# EAGLE board u1200 (EAGLE 9.6.2)
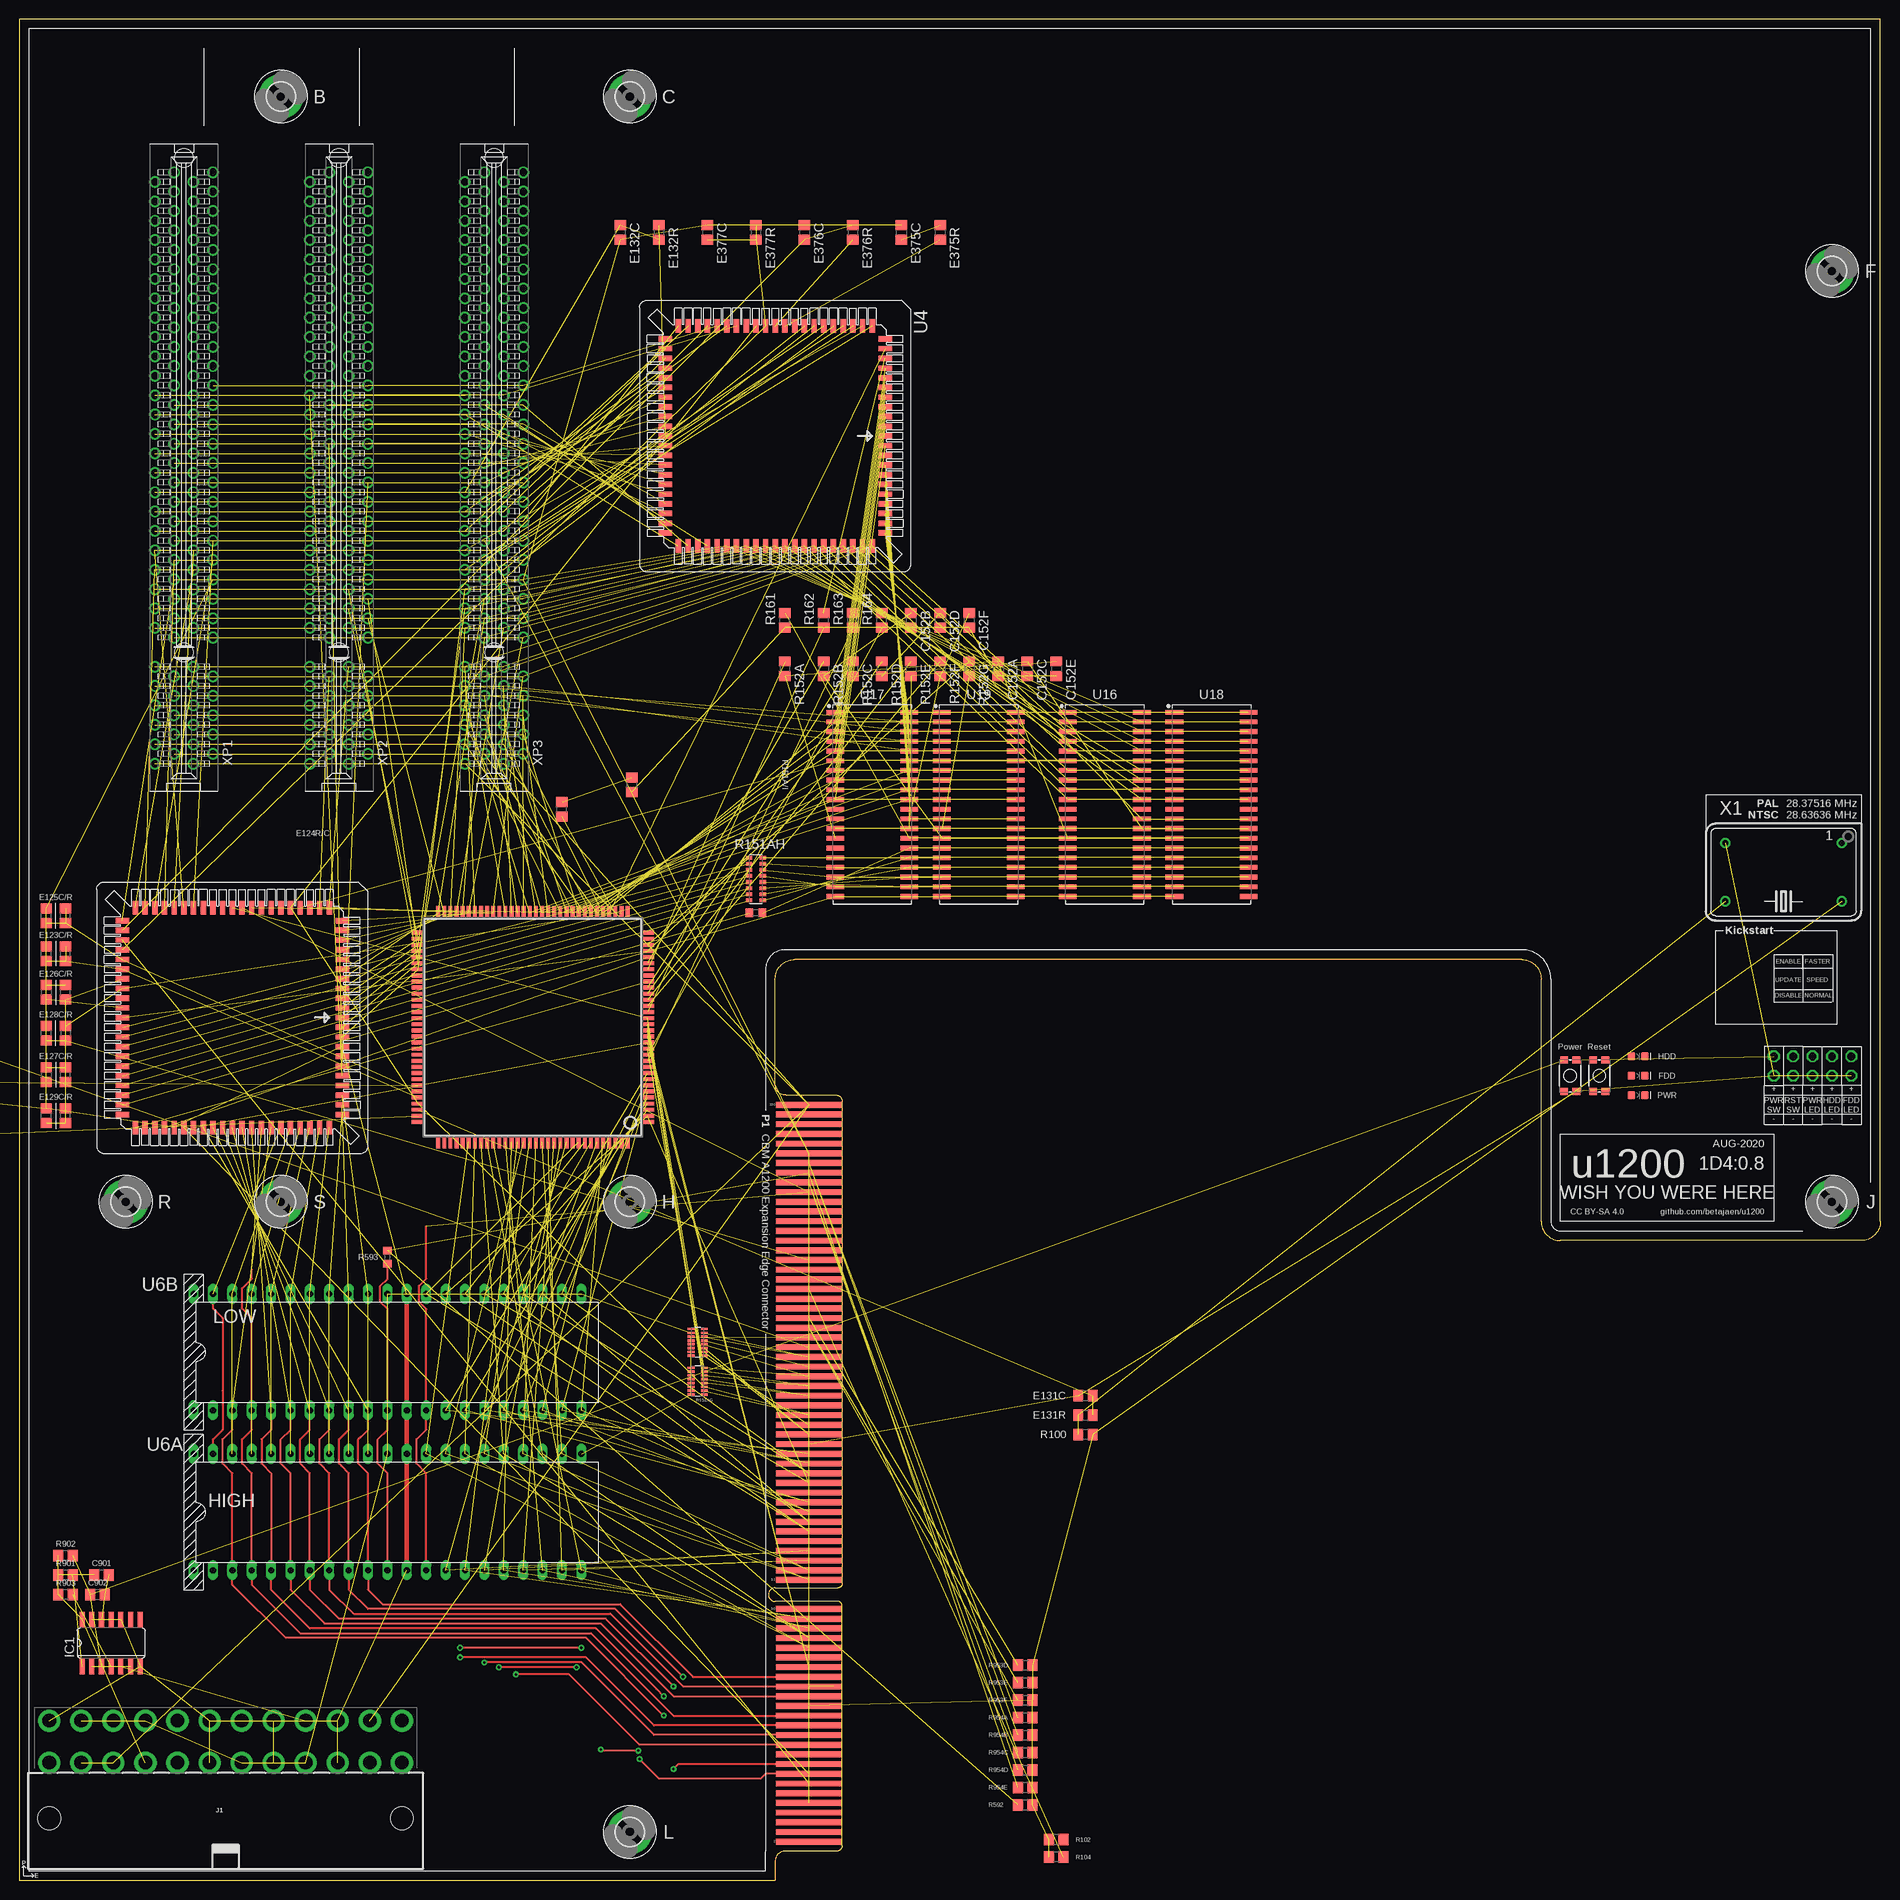
[diagram p13: board, top side]
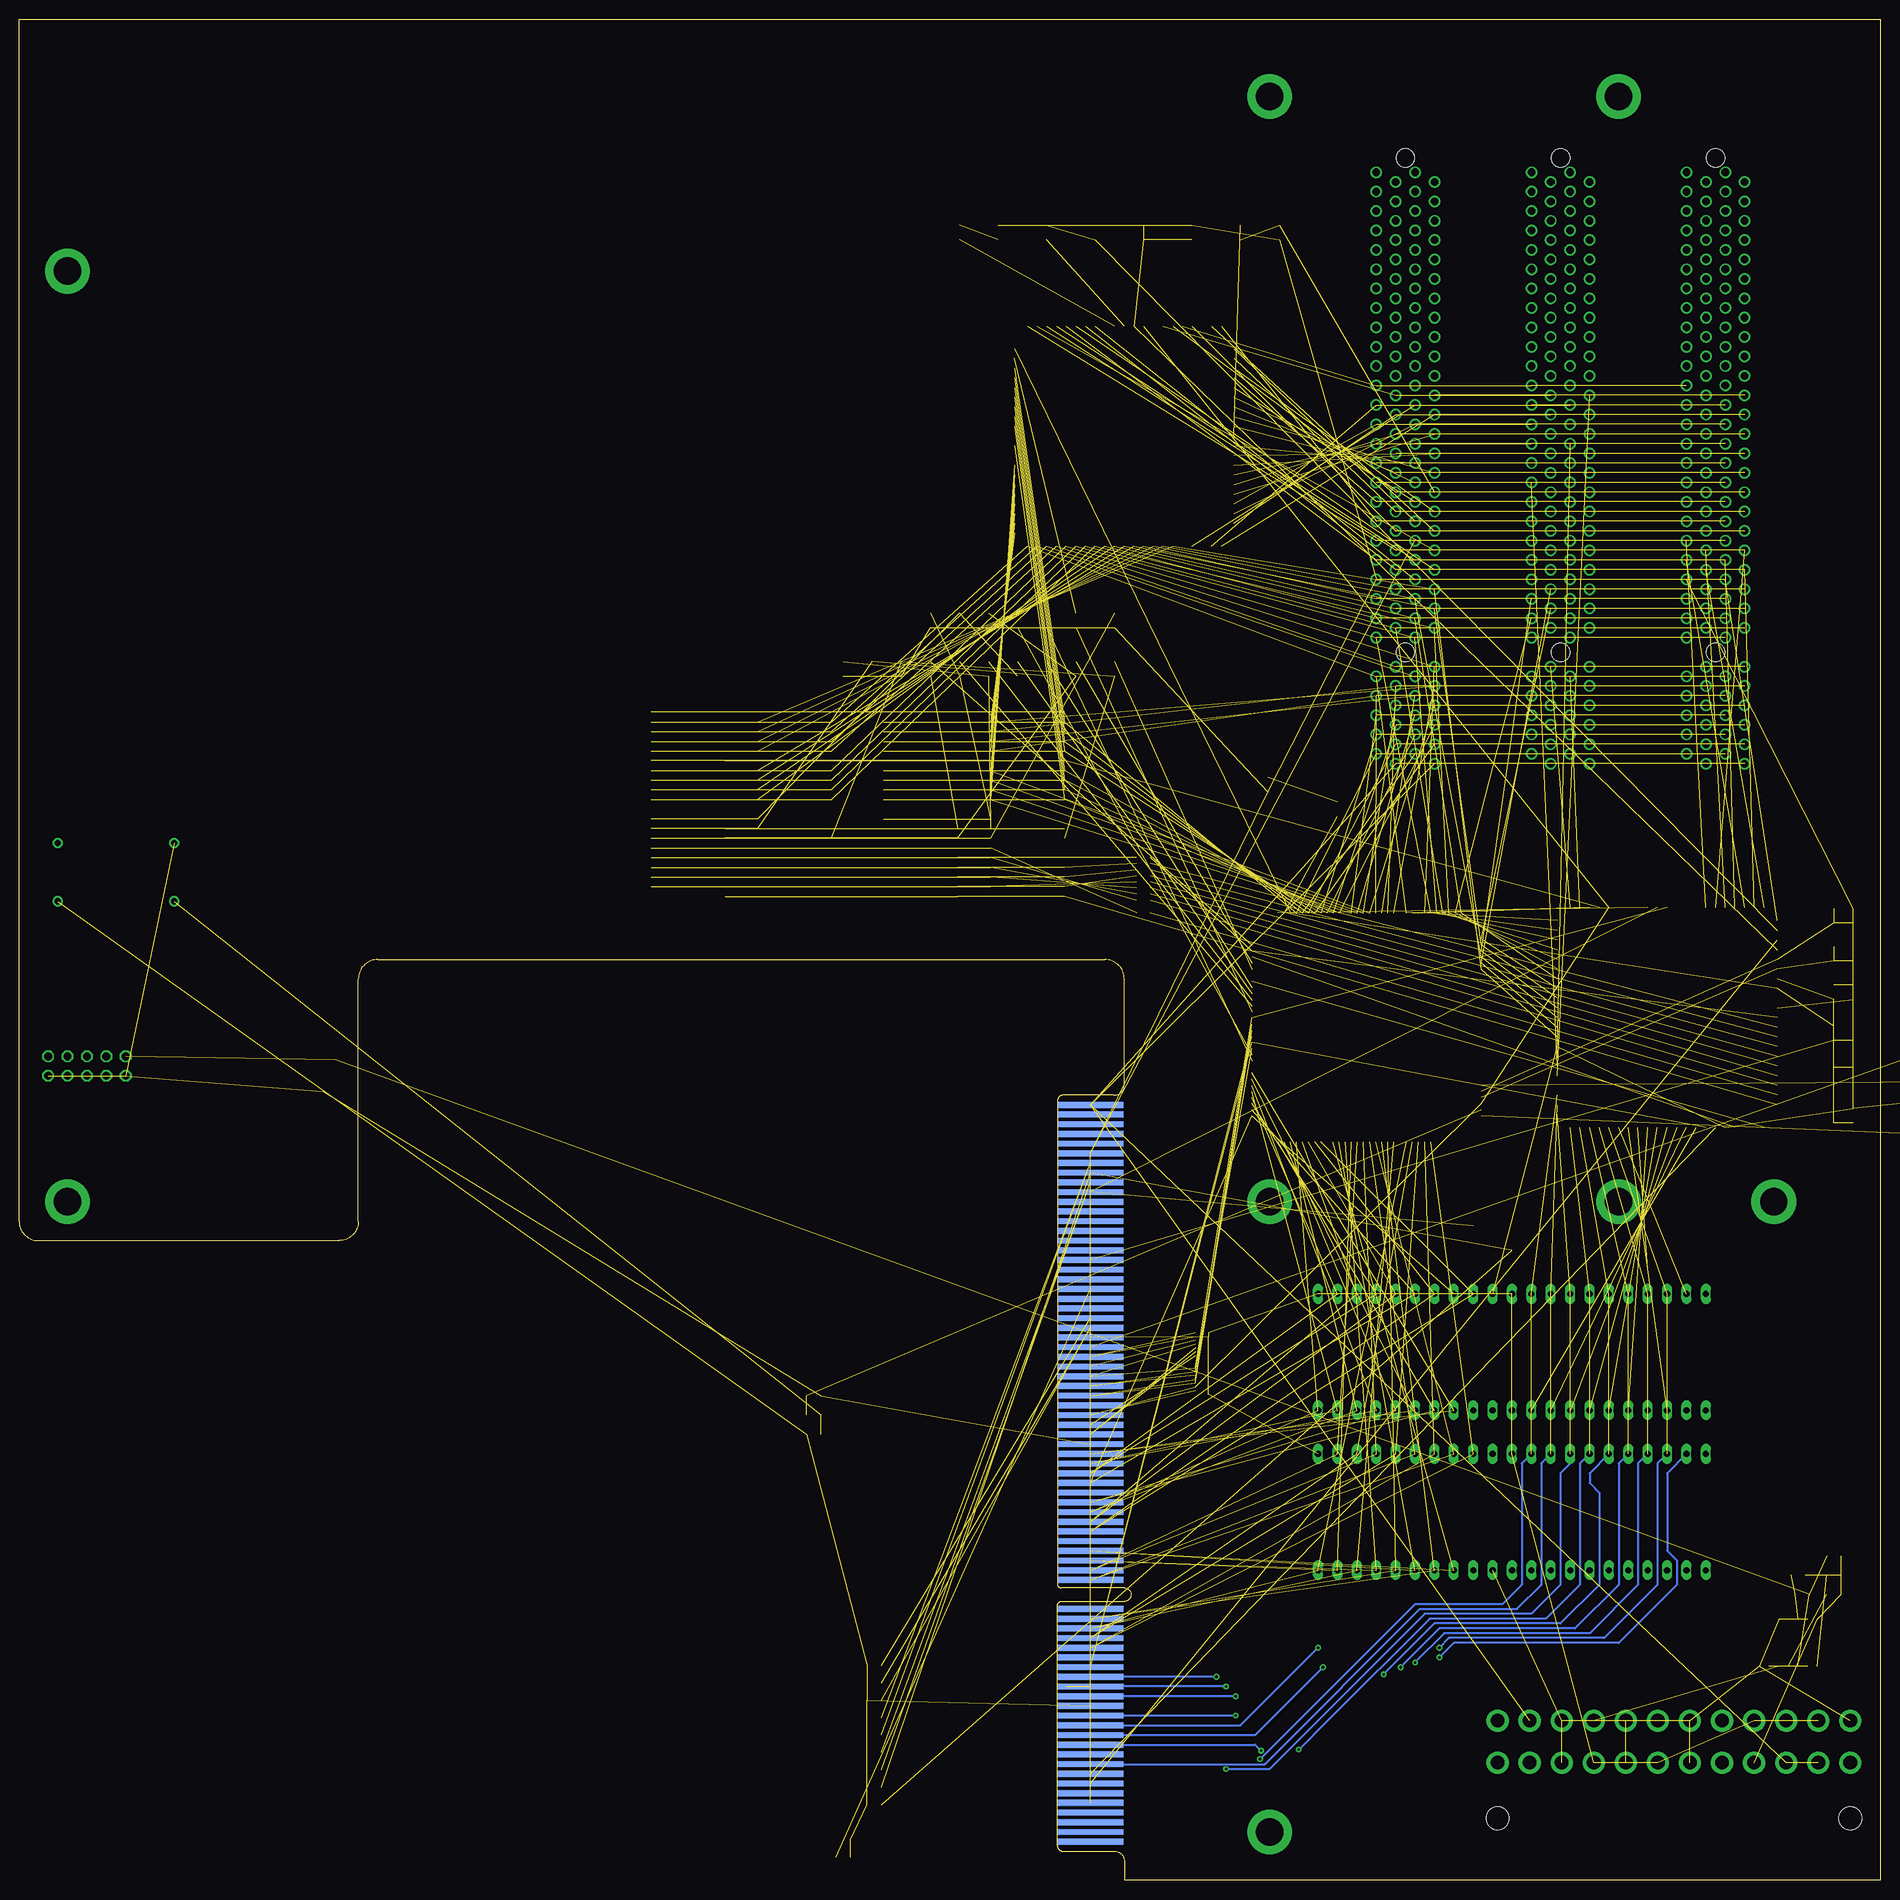
[diagram p14: board, bottom side, seen from below]

Size 243.84 x 243.84 mm. Coordinates in mm from the lower left corner, seen from the top.
Outline: 99.06,0 0,0 0,243.84 243.84,243.84 243.84,86.36 arc-90 241.3,83.82 201.93,83.82 arc-90 199.39,86.36 199.39,118.11 arc90 196.85,120.65 101.6,120.65 arc90 99.06,118.11 99.06,110.49
Copper layers (1*16): Top 0.035mm / dielectric 1.5mm / Bottom 0.035mm
Design rules "default": minimum track width 6mil, minimum drill 0.35mm, track to track 6mil, track to pad 6mil, pad to pad 6mil, via to via 6mil, smd to smd 6mil, copper to edge 40mil, drill to drill 6mil, minimum pad ring 10mil, minimum via ring 8mil, stop-mask expansion 4mil, vias tented up to drill 0mil, thermal gap 10mil
Net classes: 0 default: width 0.254 mm; 1 GND: width 0.61 mm; 2 VCC: width 0.61 mm; 3 +12V: width 0.711 mm; 4 -12V: width 0.711 mm; 5 GND_AUDIO: width 0.61 mm

## Footprints (pad centres in the part's own frame; a part is rotated, then mirrored left to right if it is on the bottom)
C0805 = smd 1.3 x 1.5: 1 -0.95,0; 2 0.95,0
R0805 = smd 1.3 x 1.5: 1 -0.95,0; 2 0.95,0
3,6-PAD = drill 3.6 pad 5.842: B3,6 0,0
SO14 = smd 0.66 x 2.032: 1 -3.81,-3.073; 2 -2.54,-3.073; 3 -1.27,-3.073; 4 0,-3.073; 5 1.27,-3.073; 6 2.54,-3.073; 7 3.81,-3.073; 8 3.81,3.073; 9 2.54,3.073; 10 1.27,3.073; 11 0,3.073; 12 -1.27,3.073; 13 -2.54,3.073; 14 -3.81,3.073
ATX24_RIGHT_ANGLE = drill 1.8 pad 2.9: 1 23.1,4.76; 2 18.9,4.76; 3 14.7,4.76; 4 10.5,4.76; 5 6.3,4.76; 6 2.1,4.76; 7 -2.1,4.76; 8 -6.3,4.76; 9 -10.5,4.76; 10 -14.7,4.76; 11 -18.9,4.76; 12 -23.1,4.76; 13 23.1,10.26; 14 18.9,10.26; 15 14.7,10.26; 16 10.5,10.26; 17 6.3,10.26; 18 2.1,10.26; 19 -2.1,10.26; 20 -6.3,10.26; 21 -10.5,10.26; 22 -14.7,10.26; 23 -18.9,10.26; 24 -23.1,10.26 | hole 3: -23.1,-2.54; 23.1,-2.54
U1200_PINHEAD_2X05_ANNOTATED = drill 1.016 octagon: 1 -5.08,-1.27; 2 -5.08,1.27; 3 -2.54,-1.27; 4 -2.54,1.27; 5 0,-1.27; 6 0,1.27; 7 2.54,-1.27; 8 2.54,1.27; 9 5.08,-1.27; 10 5.08,1.27
LED-0603 = smd 1 x 1: A -0.877,0; C 0.877,0
CBM_A1200_EDGE_CONNECTOR_150P = smd 0.762 x 8.636 bottom: P$1 0,-0.635; P$3 -1.27,-0.635; P$5 -2.54,-0.635; P$7 -3.81,-0.635; P$9 -5.08,-0.635; P$11 -6.35,-0.635; P$13 -7.62,-0.635; P$15 -8.89,-0.635; P$17 -10.16,-0.635; P$19 -11.43,-0.635; P$21 -12.7,-0.635; P$23 -13.97,-0.635; P$25 -15.24,-0.635; P$27 -16.51,-0.635; P$29 -17.78,-0.635; P$31 -19.05,-0.635; P$33 -20.32,-0.635; P$35 -21.59,-0.635; P$37 -22.86,-0.635; P$39 -24.13,-0.635; P$41 -25.4,-0.635; P$43 -26.67,-0.635; P$45 -27.94,-0.635; P$47 -29.21,-0.635; P$49 -30.48,-0.635; P$51 -34.29,-0.635; P$53 -35.56,-0.635; P$55 -36.83,-0.635; P$57 -38.1,-0.635; P$59 -39.37,-0.635; P$61 -40.64,-0.635; P$63 -41.91,-0.635; P$65 -43.18,-0.635; P$67 -44.45,-0.635; P$69 -45.72,-0.635; P$71 -46.99,-0.635; P$73 -48.26,-0.635; P$75 -49.53,-0.635; P$77 -50.8,-0.635; P$79 -52.07,-0.635; P$81 -53.34,-0.635; P$83 -54.61,-0.635; P$85 -55.88,-0.635; P$87 -57.15,-0.635; P$89 -58.42,-0.635; P$91 -59.69,-0.635; P$93 -60.96,-0.635; P$95 -62.23,-0.635; P$97 -63.5,-0.635; P$99 -64.77,-0.635; P$101 -66.04,-0.635; P$103 -67.31,-0.635; P$105 -68.58,-0.635; P$107 -69.85,-0.635; P$109 -71.12,-0.635; P$111 -72.39,-0.635; P$113 -73.66,-0.635; P$115 -74.93,-0.635; P$117 -76.2,-0.635; P$119 -77.47,-0.635; P$121 -78.74,-0.635; P$123 -80.01,-0.635; P$125 -81.28,-0.635; P$127 -82.55,-0.635; P$129 -83.82,-0.635; P$131 -85.09,-0.635; P$133 -86.36,-0.635; P$135 -87.63,-0.635; P$137 -88.9,-0.635; P$139 -90.17,-0.635; P$141 -91.44,-0.635; P$143 -92.71,-0.635; P$145 -93.98,-0.635; P$147 -95.25,-0.635; P$149 -96.52,-0.635 | smd 0.762 x 8.636: P$2 0,-0.635; P$4 -1.27,-0.635; P$6 -2.54,-0.635; P$8 -3.81,-0.635; P$10 -5.08,-0.635; P$12 -6.35,-0.635; P$14 -7.62,-0.635; P$16 -8.89,-0.635; P$18 -10.16,-0.635; P$20 -11.43,-0.635; P$22 -12.7,-0.635; P$24 -13.97,-0.635; P$26 -15.24,-0.635; P$28 -16.51,-0.635; P$30 -17.78,-0.635; P$32 -19.05,-0.635; P$34 -20.32,-0.635; P$36 -21.59,-0.635; P$38 -22.86,-0.635; P$40 -24.13,-0.635; P$42 -25.4,-0.635; P$44 -26.67,-0.635; P$46 -27.94,-0.635; P$48 -29.21,-0.635; P$50 -30.48,-0.635; P$52 -34.29,-0.635; P$54 -35.56,-0.635; P$56 -36.83,-0.635; P$58 -38.1,-0.635; P$60 -39.37,-0.635; P$62 -40.64,-0.635; P$64 -41.91,-0.635; P$66 -43.18,-0.635; P$68 -44.45,-0.635; P$70 -45.72,-0.635; P$72 -46.99,-0.635; P$74 -48.26,-0.635; P$76 -49.53,-0.635; P$78 -50.8,-0.635; P$80 -52.07,-0.635; P$82 -53.34,-0.635; P$84 -54.61,-0.635; P$86 -55.88,-0.635; P$88 -57.15,-0.635; P$90 -58.42,-0.635; P$92 -59.69,-0.635; P$94 -60.96,-0.635; P$96 -62.23,-0.635; P$98 -63.5,-0.635; P$100 -64.77,-0.635; P$102 -66.04,-0.635; P$104 -67.31,-0.635; P$106 -68.58,-0.635; P$108 -69.85,-0.635; P$110 -71.12,-0.635; P$112 -72.39,-0.635; P$114 -73.66,-0.635; P$116 -74.93,-0.635; P$118 -76.2,-0.635; P$120 -77.47,-0.635; P$122 -78.74,-0.635; P$124 -80.01,-0.635; P$126 -81.28,-0.635; P$128 -82.55,-0.635; P$130 -83.82,-0.635; P$132 -85.09,-0.635; P$134 -86.36,-0.635; P$136 -87.63,-0.635; P$138 -88.9,-0.635; P$140 -90.17,-0.635; P$142 -91.44,-0.635; P$144 -92.71,-0.635; P$146 -93.98,-0.635; P$148 -95.25,-0.635; P$150 -96.52,-0.635
TACTILE_SWITCH_SMD_4.6X2.8MM = smd 0.9 x 1: 1 -2.05,-0.8; 2 2.05,-0.8; 3 2.05,0.8; 4 -2.05,0.8
741X163220JP = smd 0.878 x 0.297: 1 -0.867,1.75; 8 -0.867,-1.75; 9 0.867,-1.75; 16 0.867,1.75 | smd 0.878 x 0.31: 2 -0.867,1.25; 3 -0.867,0.75; 4 -0.867,0.25; 5 -0.867,-0.25; 6 -0.867,-0.75; 7 -0.867,-1.25; 10 0.867,-1.25; 11 0.867,-0.75; 12 0.867,-0.25; 13 0.867,0.25; 14 0.867,0.75; 15 0.867,1.25
742C163220JP = smd 0.792 x 0.472: 1 -0.91,2.8; 2 -0.91,2; 3 -0.91,1.2; 4 -0.91,0.4; 5 -0.91,-0.4; 6 -0.91,-1.2; 7 -0.91,-2; 8 -0.91,-2.8; 9 0.91,-2.8; 10 0.91,-2; 11 0.91,-1.2; 12 0.91,-0.4; 13 0.91,0.4; 14 0.91,1.2; 15 0.91,2; 16 0.91,2.8
R0603 = smd 1 x 1.1: 1 -0.85,0; 2 0.85,0
PLCC84-SMD-AMP-SOCKED = smd 0.7 x 1.78: 1 0,14.4; 2 -1.27,14.4; 3 -2.54,14.4; 4 -3.81,14.4; 5 -5.08,14.4; 6 -6.35,14.4; 7 -7.62,14.4; 8 -8.89,14.4; 9 -10.16,14.4; 10 -11.43,14.4; 11 -12.7,14.4; 33 -12.7,-14.4; 34 -11.43,-14.4; 35 -10.16,-14.4; 36 -8.89,-14.4; 37 -7.62,-14.4; 38 -6.35,-14.4; 39 -5.08,-14.4; 40 -3.81,-14.4; 41 -2.54,-14.4; 42 -1.27,-14.4; 43 0,-14.4; 44 1.27,-14.4; 45 2.54,-14.4; 46 3.81,-14.4; 47 5.08,-14.4; 48 6.35,-14.4; 49 7.62,-14.4; 50 8.89,-14.4; 51 10.16,-14.4; 52 11.43,-14.4; 53 12.7,-14.4; 75 12.7,14.4; 76 11.43,14.4; 77 10.16,14.4; 78 8.89,14.4; 79 7.62,14.4; 80 6.35,14.4; 81 5.08,14.4; 82 3.81,14.4; 83 2.54,14.4; 84 1.27,14.4 | smd 1.78 x 0.7: 12 -14.4,12.7; 13 -14.4,11.43; 14 -14.4,10.16; 15 -14.4,8.89; 16 -14.4,7.62; 17 -14.4,6.35; 18 -14.4,5.08; 19 -14.4,3.81; 20 -14.4,2.54; 21 -14.4,1.27; 22 -14.4,0; 23 -14.4,-1.27; 24 -14.4,-2.54; 25 -14.4,-3.81; 26 -14.4,-5.08; 27 -14.4,-6.35; 28 -14.4,-7.62; 29 -14.4,-8.89; 30 -14.4,-10.16; 31 -14.4,-11.43; 32 -14.4,-12.7; 54 14.4,-12.7; 55 14.4,-11.43; 56 14.4,-10.16; 57 14.4,-8.89; 58 14.4,-7.62; 59 14.4,-6.35; 60 14.4,-5.08; 61 14.4,-3.81; 62 14.4,-2.54; 63 14.4,-1.27; 64 14.4,0; 65 14.4,1.27; 66 14.4,2.54; 67 14.4,3.81; 68 14.4,5.08; 69 14.4,6.35; 70 14.4,7.62; 71 14.4,8.89; 72 14.4,10.16; 73 14.4,11.43; 74 14.4,12.7
CBM_A1200_ROM_DIL42 = drill 0.813 long: 1 -25.4,-7.62; 2 -22.86,-7.62; 3 -20.32,-7.62; 4 -17.78,-7.62; 5 -15.24,-7.62; 6 -12.7,-7.62; 7 -10.16,-7.62; 8 -7.62,-7.62; 9 -5.08,-7.62; 10 -2.54,-7.62; 11 0,-7.62; 12 2.54,-7.62; 13 5.08,-7.62; 14 7.62,-7.62; 15 10.16,-7.62; 16 12.7,-7.62; 17 15.24,-7.62; 18 17.78,-7.62; 19 20.32,-7.62; 20 22.86,-7.62; 21 25.4,-7.62; 22 25.4,7.62; 23 22.86,7.62; 24 20.32,7.62; 25 17.78,7.62; 26 15.24,7.62; 27 12.7,7.62; 28 10.16,7.62; 29 7.62,7.62; 30 5.08,7.62; 31 2.54,7.62; 32 0,7.62; 33 -2.54,7.62; 34 -5.08,7.62; 35 -7.62,7.62; 36 -10.16,7.62; 37 -12.7,7.62; 38 -15.24,7.62; 39 -17.78,7.62; 40 -20.32,7.62; 41 -22.86,7.62; 42 -25.4,7.62
SOJ127P1117X376-40 = smd 2.315 x 0.612: 1 -4.854,12.065; 2 -4.854,10.795; 3 -4.854,9.525; 4 -4.854,8.255; 5 -4.854,6.985; 6 -4.854,5.715; 7 -4.854,4.445; 8 -4.854,3.175; 9 -4.854,1.905; 10 -4.854,0.635; 11 -4.854,-0.635; 12 -4.854,-1.905; 13 -4.854,-3.175; 14 -4.854,-4.445; 15 -4.854,-5.715; 16 -4.854,-6.985; 17 -4.854,-8.255; 18 -4.854,-9.525; 19 -4.854,-10.795; 20 -4.854,-12.065; 21 4.854,-12.065; 22 4.854,-10.795; 23 4.854,-9.525; 24 4.854,-8.255; 25 4.854,-6.985; 26 4.854,-5.715; 27 4.854,-4.445; 28 4.854,-3.175; 29 4.854,-1.905; 30 4.854,-0.635; 31 4.854,0.635; 32 4.854,1.905; 33 4.854,3.175; 34 4.854,4.445; 35 4.854,5.715; 36 4.854,6.985; 37 4.854,8.255; 38 4.854,9.525; 39 4.854,10.795; 40 4.854,12.065
SQFP-S-28X28-128 = smd 0.5 x 1.8: 1 -12.4,-15; 2 -11.6,-15; 3 -10.8,-15; 4 -10,-15; 5 -9.2,-15; 6 -8.4,-15; 7 -7.6,-15; 8 -6.8,-15; 9 -6,-15; 10 -5.2,-15; 11 -4.4,-15; 12 -3.6,-15; 13 -2.8,-15; 14 -2,-15; 15 -1.2,-15; 16 -0.4,-15; 17 0.4,-15; 18 1.2,-15; 19 2,-15; 20 2.8,-15; 21 3.6,-15; 22 4.4,-15; 23 5.2,-15; 24 6,-15; 25 6.8,-15; 26 7.6,-15; 27 8.4,-15; 28 9.2,-15; 29 10,-15; 30 10.8,-15; 31 11.6,-15; 32 12.4,-15; 65 12.4,15; 66 11.6,15; 67 10.8,15; 68 10,15; 69 9.2,15; 70 8.4,15; 71 7.6,15; 72 6.8,15; 73 6,15; 74 5.2,15; 75 4.4,15; 76 3.6,15; 77 2.8,15; 78 2,15; 79 1.2,15; 80 0.4,15; 81 -0.4,15; 82 -1.2,15; 83 -2,15; 84 -2.8,15; 85 -3.6,15; 86 -4.4,15; 87 -5.2,15; 88 -6,15; 89 -6.8,15; 90 -7.6,15; 91 -8.4,15; 92 -9.2,15; 93 -10,15; 94 -10.8,15; 95 -11.6,15; 96 -12.4,15 | smd 1.8 x 0.5: 33 15,-12.4; 34 15,-11.6; 35 15,-10.8; 36 15,-10; 37 15,-9.2; 38 15,-8.4; 39 15,-7.6; 40 15,-6.8; 41 15,-6; 42 15,-5.2; 43 15,-4.4; 44 15,-3.6; 45 15,-2.8; 46 15,-2; 47 15,-1.2; 48 15,-0.4; 49 15,0.4; 50 15,1.2; 51 15,2; 52 15,2.8; 53 15,3.6; 54 15,4.4; 55 15,5.2; 56 15,6; 57 15,6.8; 58 15,7.6; 59 15,8.4; 60 15,9.2; 61 15,10; 62 15,10.8; 63 15,11.6; 64 15,12.4; 97 -15,12.4; 98 -15,11.6; 99 -15,10.8; 100 -15,10; 101 -15,9.2; 102 -15,8.4; 103 -15,7.6; 104 -15,6.8; 105 -15,6; 106 -15,5.2; 107 -15,4.4; 108 -15,3.6; 109 -15,2.8; 110 -15,2; 111 -15,1.2; 112 -15,0.4; 113 -15,-0.4; 114 -15,-1.2; 115 -15,-2; 116 -15,-2.8; 117 -15,-3.6; 118 -15,-4.4; 119 -15,-5.2; 120 -15,-6; 121 -15,-6.8; 122 -15,-7.6; 123 -15,-8.4; 124 -15,-9.2; 125 -15,-10; 126 -15,-10.8; 127 -15,-11.6; 128 -15,-12.4
DIL14S = drill 0.813: 1 -7.62,-3.81; 7 7.62,-3.81; 8 7.62,3.81; 14 -7.62,3.81
145167-2 = drill 1 pad 1.2: 1 0.254,-1.27; 2 0.254,3.81; 3 1.524,-3.81; 4 1.524,1.27; 5 2.794,-1.27; 6 2.794,3.81; 7 4.064,-3.81; 8 4.064,1.27; 9 5.334,-1.27; 10 5.334,3.81; 11 6.604,-3.81; 12 6.604,1.27; 13 7.874,-1.27; 14 7.874,3.81; 15 9.144,-3.81; 16 9.144,1.27; 17 10.414,-1.27; 18 10.414,3.81; 19 11.684,-3.81; 20 11.684,1.27; 21 12.954,-1.27; 22 12.954,3.81; 23 16.764,-3.81; 24 16.764,1.27; 25 18.034,-1.27; 26 18.034,3.81; 27 19.304,-3.81; 28 19.304,1.27; 29 20.574,-1.27; 30 20.574,3.81; 31 21.844,-3.81; 32 21.844,1.27; 33 23.114,-1.27; 34 23.114,3.81; 35 24.384,-3.81; 36 24.384,1.27; 37 25.654,-1.27; 38 25.654,3.81; 39 26.924,-3.81; 40 26.924,1.27; 41 28.194,-1.27; 42 28.194,3.81; 43 29.464,-3.81; 44 29.464,1.27; 45 30.734,-1.27; 46 30.734,3.81; 47 32.004,-3.81; 48 32.004,1.27; 49 33.274,-1.27; 50 33.274,3.81; 51 34.544,-3.81; 52 34.544,1.27; 53 35.814,-1.27; 54 35.814,3.81; 55 37.084,-3.81; 56 37.084,1.27; 57 38.354,-1.27; 58 38.354,3.81; 59 39.624,-3.81; 60 39.624,1.27; 61 40.894,-1.27; 62 40.894,3.81; 63 42.164,-3.81; 64 42.164,1.27; 65 43.434,-1.27; 66 43.434,3.81; 67 44.704,-3.81; 68 44.704,1.27; 69 45.974,-1.27; 70 45.974,3.81; 71 47.244,-3.81; 72 47.244,1.27; 73 48.514,-1.27; 74 48.514,3.81; 75 49.784,-3.81; 76 49.784,1.27; 77 51.054,-1.27; 78 51.054,3.81; 79 52.324,-3.81; 80 52.324,1.27; 81 53.594,-1.27; 82 53.594,3.81; 83 54.864,-3.81; 84 54.864,1.27; 85 56.134,-1.27; 86 56.134,3.81; 87 57.404,-3.81; 88 57.404,1.27; 89 58.674,-1.27; 90 58.674,3.81; 91 59.944,-3.81; 92 59.944,1.27; 93 61.214,-1.27; 94 61.214,3.81; 95 62.484,-3.81; 96 62.484,1.27; 97 63.754,-1.27; 98 63.754,3.81; 99 65.024,-3.81; 100 65.024,1.27; 101 66.294,-1.27; 102 66.294,3.81; 103 67.564,-3.81; 104 67.564,1.27; 105 68.834,-1.27; 106 68.834,3.81; 107 70.104,-3.81; 108 70.104,1.27; 109 71.374,-1.27; 110 71.374,3.81; 111 72.644,-3.81; 112 72.644,1.27; 113 73.914,-1.27; 114 73.914,3.81; 115 75.184,-3.81; 116 75.184,1.27; 117 76.454,-1.27; 118 76.454,3.81; 119 77.724,-3.81; 120 77.724,1.27 | hole 2.44: 14.854,0; 79.624,0

## Placement (x,y rotation side)
C152A  22pF  [C0805]  128.27,158.75 270 top
C152B  22pF  [C0805]  116.84,165.1 270 top
C152C  22pF  [C0805]  132.08,158.75 270 top
C152D  22pF  [C0805]  120.65,165.1 270 top
C152E  22pF  [C0805]  135.89,158.75 270 top
C152F  22pF  [C0805]  124.46,165.1 270 top
C901  100nF  [C0805]  10.79,40.01 0 top
C902  CPO  [C0805]  10.29,37.47 0 top
E121C  *  [C0805]  -11.68,103.63 270 top  (outside the outline)
E121R  27  [R0805]  -9.02,103.63 90 top  (outside the outline)
E122C  *  [C0805]  -11.68,108.71 270 top  (outside the outline)
E122R  27  [R0805]  -9.02,108.71 90 top  (outside the outline)
E123C  22pF  [C0805]  3.56,121.41 90 top
E123R  27  [R0805]  6.1,121.41 90 top
E124C  22pF  [C0805]  80.26,143.51 270 top
E124R  68  [R0805]  71.12,140.34 90 top
E125C  22pF  [C0805]  3.56,126.36 90 top
E125R  27  [R0805]  6.1,126.36 90 top
E126C  22pF  [C0805]  3.56,116.33 270 top
E126R  27  [R0805]  6.1,116.33 90 top
E127C  22pF  [C0805]  3.56,105.54 270 top
E127R  27  [R0805]  6.1,105.54 90 top
E128C  22pF  [C0805]  3.56,111 90 top
E128R  27  [R0805]  6.1,111 270 top
E129C  22pF  [C0805]  3.56,100.2 90 top
E129R  27  [R0805]  6.1,100.2 90 top
E131C  *  [C0805]  139.7,63.5 180 top
E131R  68  [R0805]  139.7,60.96 0 top
E132C  *  [C0805]  78.74,215.9 270 top
E132R  68  [R0805]  83.82,215.9 270 top
E133C  *  [C0805]  -11.68,98.55 270 top  (outside the outline)
E133R  68  [R0805]  -9.02,98.55 90 top  (outside the outline)
E375C  22pF  [C0805]  115.57,215.9 270 top
E375R  68  [R0805]  120.65,215.9 270 top
E376C  22pF  [C0805]  102.87,215.9 270 top
E376R  68  [R0805]  109.22,215.9 270 top
E377C  22pF  [C0805]  90.17,215.9 270 top
E377R  68  [R0805]  96.52,215.9 270 top
HB  MOUNT-PAD-ROUND3.6  [3,6-PAD]  34.29,233.68 0 top
HC  MOUNT-PAD-ROUND3.6  [3,6-PAD]  80.01,233.68 0 top
HF  MOUNT-PAD-ROUND3.6  [3,6-PAD]  237.49,210.82 0 top
HH  MOUNT-PAD-ROUND3.6  [3,6-PAD]  80.01,88.9 180 top
HJ  MOUNT-PAD-ROUND3.6  [3,6-PAD]  237.49,88.9 0 top
HL  MOUNT-PAD-ROUND3.6  [3,6-PAD]  80.01,6.35 0 top
HR  MOUNT-PAD-ROUND3.6  [3,6-PAD]  13.97,88.9 0 top
HS  MOUNT-PAD-ROUND3.6  [3,6-PAD]  34.29,88.9 0 top
IC1  74LS74D  [SO14]  12.06,31.11 0 top
J1  ATX24RH  [ATX24_RIGHT_ANGLE]  27.05,10.67 0 top
JP1  U1200_JP_CASEU1200_JP_CASE  [U1200_PINHEAD_2X05_ANNOTATED]  234.95,106.68 0 top
LED_FDD  Yellow  [LED-0603]  212.09,105.41 0 top
LED_HDD  RED  [LED-0603]  212.09,107.95 0 top
LED_PWR  GREEN  [LED-0603]  212.09,102.87 0 top
P1  CBM_A1200_EDGE_CONNECTOR  [CBM_A1200_EDGE_CONNECTOR_150P]  104.14,5.08 270 top
PWR_SW  [TACTILE_SWITCH_SMD_4.6X2.8MM]  203.2,105.41 270 top
R100  470  [R0805]  139.7,58.42 180 top
R101_104_952AB  741X163220JP  [741X163220JP]  88.9,70.48 180 top
R102  1K  [R0805]  135.89,5.33 180 top
R104  1K  [R0805]  135.89,3.05 180 top
R151AH  742C043680JP  [742C163220JP]  96.52,131.19 0 top
R151I  68  [R0603]  96.52,126.75 0 top
R152A  68  [R0805]  100.33,158.75 270 top
R152B  68  [R0805]  105.41,158.75 270 top
R152C  68  [R0805]  109.22,158.75 270 top
R152D  68  [R0805]  113.03,158.75 270 top
R152E  68  [R0805]  116.84,158.75 270 top
R152F  68  [R0805]  120.65,158.75 270 top
R152G  68  [R0805]  124.46,158.75 270 top
R161  470  [R0805]  100.33,165.1 90 top
R162  27  [R0805]  105.41,165.1 90 top
R163  68  [R0805]  109.22,165.1 90 top
R164  68  [R0805]  113.03,165.1 90 top
R592  1K  [R0805]  131.83,9.91 0 top
R593  470**  [R0603]  48.26,81.66 270 top
R901  4K7  [R0805]  6.1,40.01 180 top
R902  4K7  [R0805]  6.1,42.55 180 top
R903  4K7  [R0805]  6.1,37.47 180 top
R951AG  741X163220JP  [741X163220JP]  88.9,65.41 180 top
R953D  470  [R0805]  131.83,28.19 0 top
R953E  470  [R0805]  131.83,25.91 0 top
R953F  470  [R0805]  131.83,23.62 0 top
R954A  1K  [R0805]  131.83,21.34 0 top
R954B  1K  [R0805]  131.83,19.05 0 top
R954C  470  [R0805]  131.83,16.76 0 top
R954D  470  [R0805]  131.83,14.48 0 top
R954E  1K  [R0805]  131.83,12.19 0 top
RST_SW  [TACTILE_SWITCH_SMD_4.6X2.8MM]  207.01,105.41 270 top
U2  CBM_8374  [PLCC84-SMD-AMP-SOCKED]  27.94,113.03 270 top
U4  CBM_4203  [PLCC84-SMD-AMP-SOCKED]  99.06,189.23 270 top
U6A  CBM_A1200_ROM_U6AB  [CBM_A1200_ROM_DIL42]  48.26,48.26 0 top
U6B  CBM_A1200_ROM_U6AB  [CBM_A1200_ROM_DIL42]  48.26,69.22 0 top
U16  DRAM_256KX16  [SOJ127P1117X376-40]  142.24,140.97 0 top
U17  DRAM_256KX16  [SOJ127P1117X376-40]  111.76,140.97 0 top
U18  DRAM_256KX16  [SOJ127P1117X376-40]  156.21,140.97 0 top
U19  DRAM_256KX16  [SOJ127P1117X376-40]  125.73,140.97 0 top
U20  CBM_391425  [SQFP-S-28X28-128]  67.31,111.76 90 top
U$1  REF_P5_A1200_PPC_040  [REF_P5_A1200_PPC_040]  100.33,0 0 top
X1  [DIL14S]  231.14,132.08 180 top
XP1  U1200_CHIP_BUS_CONNECTOR  [145167-2]  21.59,146.05 90 top
XP2  U1200_CHIP_BUS_CONNECTOR  [145167-2]  41.91,146.05 90 top
XP3  U1200_CHIP_BUS_CONNECTOR  [145167-2]  62.23,146.05 90 top

## Tracks (layer width: path | path; a pad name or v marks a point on that pad's centre or on a via)
7MHZ  (4 unrouted)
14MHZ  (4 unrouted)
28MHZ  (1 unrouted)
+12V  (5 unrouted)
-12V  (4 unrouted)
_AS  (1 unrouted)
_AVEC  (1 unrouted)
_BCAS_XX  (1 unrouted)
_BEER  (1 unrouted)
_BR  (1 unrouted)
_BRAS(0)  (3 unrouted)
_BRAS(1)  (3 unrouted)
_BRAS_LL  (3 unrouted)
_BRAS_LM  (3 unrouted)
_BRAS_UM  (3 unrouted)
_BRAS_UU  (3 unrouted)
_BWE  (4 unrouted)
_CAS  (1 unrouted)
_CDAC  (4 unrouted)
_CSYNC  (3 unrouted)
_DBR  (1 unrouted)
_DS  (2 unrouted)
_DSACK_0  (1 unrouted)
_DSACK_1  (1 unrouted)
_HLT  (1 unrouted)
_HSYNC  (3 unrouted)
_INT2  (1 unrouted)
_INT6  (1 unrouted)
_MLD  (1 unrouted)
_OE  (1 unrouted)
  Top 0.254: U6A.13 53.34,53.34 52.07,54.61 52.07,57.78 53.34,59.05 U6B.13 53.34,74.85 52.4,75.78 52.4,77.89 53.34,78.82 53.34,85.72
_OVR  (1 unrouted)
_RAS  (1 unrouted)
_ROE  (4 unrouted)
_ROMEN
  Top 0.254: U6A.11 48.26,53.34 46.99,54.61 46.99,57.78 48.26,59.05 U6B.11 48.26,74.85 47.32,75.78 47.32,77.89 48.26,78.82 R593.2
_RST  (4 unrouted)
_VSYNC  (3 unrouted)
_WE  (1 unrouted)
_WIDE  (2 unrouted)
_XBLANK  (3 unrouted)
_XRGB0  (3 unrouted)
_XRGB1  (3 unrouted)
_XRGB2  (3 unrouted)
_XRGB3  (3 unrouted)
_XRGB4  (3 unrouted)
_XRGB5  (3 unrouted)
_XRGB6  (3 unrouted)
_XRGB7  (3 unrouted)
_XRGB8  (3 unrouted)
_XRGB9  (3 unrouted)
_XRGB10  (3 unrouted)
_XRGB11  (3 unrouted)
_XRGB12  (3 unrouted)
_XRGB13  (3 unrouted)
_XRGB14  (3 unrouted)
_XRGB15  (3 unrouted)
_XRGB16  (3 unrouted)
_XRGB17  (3 unrouted)
_XRGB18  (3 unrouted)
_XRGB19  (3 unrouted)
_XRGB20  (3 unrouted)
_XRGB21  (3 unrouted)
_XRGB22  (3 unrouted)
_XRGB23  (3 unrouted)
_ZORRO  (1 unrouted)
A0  (1 unrouted)
A1  (2 unrouted)
A2  (1 unrouted)
  Top 0.254: P1.P$36 88.27,26.67 78.74,36.2 47.62,36.2 45.72,38.1 U6A.10 45.72,53.34 44.45,54.61 44.45,57.78 44.78,58.12 45.72,59.05 U6B.10
A3  (via drill 0.35)  (1 unrouted)
  Top 0.254: U6B.9 43.18,59.05 41.91,57.78 41.91,54.61 42.24,54.28 43.18,53.34 U6A.9 43.18,38.1 45.72,35.56 78.11,35.56 v87,26.67
  Bottom 0.254: v87,26.67 P1.P$35
A4  (2 unrouted)
  Top 0.254: 106.68,25.4 87,25.4 77.47,34.92 43.81,34.92 40.64,38.1 U6A.8 40.64,53.34 39.37,54.61 39.37,57.78 40.64,59.05 U6B.8
A5  (via drill 0.35)  (1 unrouted)
  Top 0.254: U6B.7 38.1,59.05 36.83,57.78 36.83,54.61 38.1,53.34 U6A.7 38.1,38.1 41.91,34.29 76.83,34.29 v85.72,25.4
  Bottom 0.254: v85.72,25.4 P1.P$33
A6  (1 unrouted)
  Top 0.254: P1.P$32 85.72,24.13 76.2,33.66 40.01,33.66 35.56,38.1 U6A.6 35.56,53.34 34.29,54.61 34.29,57.78 35.56,59.05 U6B.6
A7  (via drill 0.35)  (1 unrouted)
  Top 0.254: U6B.5 33.02,59.05 31.75,57.78 31.75,54.61 33.02,53.34 U6A.5 33.02,38.1 38.1,33.02 75.56,33.02 83.5,25.08 v84.45,24.13
  Bottom 0.254: v84.45,24.13 P1.P$31
A8  (1 unrouted)
  Top 0.254: 30.48,80.01 30.48,78.82 29.21,77.55 29.21,74.93 30.48,73.66 U6B.4 30.48,59.05 29.21,57.78 29.21,54.61 30.48,53.34 U6A.4 30.48,38.73 36.83,32.38 74.93,32.38 85.72,21.59 P1.P$28
A9  (via drill 0.35)  (1 unrouted)
  Top 0.254: U6B.3 27.94,59.05 26.67,57.78 26.67,54.61 27.94,53.34 U6A.3 27.94,38.73 34.92,31.75 74.3,31.75 v84.45,21.59
  Bottom 0.254: v84.45,21.59 P1.P$27
A10  (via drill 0.35)  (1 unrouted)
  Top 0.254: U6A.41 25.4,57.78 26.67,59.05 26.67,64.14 26.67,73.66 25.4,74.93 U6B.41 | v57.78,29.21 74.3,29.21 83.19,20.32 P1.P$26
  Bottom 0.254: U6A.41 27.94,53.34 27.94,43.18 26.67,41.91 26.67,38.73 34.29,31.11 55.88,31.11 v57.78,29.21
A11  (via drill 0.35)  (2 unrouted)
  Top 0.254: v73.66,30.48 v57.78,30.48
  Bottom 0.254: U6A.40 29.21,54.61 29.21,38.73 36.2,31.75 56.52,31.75 v57.78,30.48 | P1.P$25 83.82,20.32 v73.66,30.48
A12  (via drill 0.35)  (2 unrouted)
  Top 0.254: P1.P$24 83.19,19.05 73.66,28.57 60.98,28.57 v60.96,28.55
  Bottom 0.254: U6A.39 31.75,54.61 31.75,38.73 38.1,32.38 57.15,32.38 60.96,28.57 v60.96,28.55
A13  (via drill 0.35)  (2 unrouted)
  Top 0.254: v73.03,27.92 v62.87,27.92
  Bottom 0.254: U6A.38 34.29,54.61 34.29,38.73 40.01,33.02 57.78,33.02 62.87,27.94 v62.87,27.92 | P1.P$23 81.89,19.05 v73.03,27.92
A14  (via drill 0.35)  (2 unrouted)
  Top 0.254: v65.09,26.99 72.07,26.99 81.28,17.78 P1.P$22
  Bottom 0.254: U6A.37 38.1,53.34 38.1,52.07 36.83,50.8 36.83,38.73 41.91,33.66 58.42,33.66 v65.09,26.99
A15  (via drill 0.35)  (2 unrouted)
  Top 0.254: v81.13,17 76.35,17 v76.2,17.14
  Bottom 0.254: U6A.36 39.37,54.61 39.37,38.73 43.81,34.29 59.05,34.29 72.39,20.95 v76.2,17.14 | v81.13,17 81.92,17.78 P1.P$21
A16  (via drill 0.35)  (2 unrouted)
  Top 0.254: P1.P$18 86.36,15.24 v85.72,14.61
  Bottom 0.254: U6A.35 40.64,54.61 41.91,53.34 41.91,38.73 45.72,34.92 59.69,34.92 75.88,18.73 | 75.88,18.73 80.01,14.61 v85.72,14.61 | 75.88,18.73 76.2,18.41
A17  (2 unrouted)
  Bottom 0.254: U6A.34 44.45,54.61 44.45,39.29 44.45,38.73 47.62,35.56 60.33,35.56 80.64,15.24 P1.P$17
A18  (via drill 0.35)  (2 unrouted)
  Top 0.254: P1.P$16 97.79,13.97 97.16,13.34 83.82,13.34 81.28,15.88 v81.28,15.9
  Bottom 0.254: U6A.33 46.99,54.61 46.99,38.73 49.53,36.2 60.96,36.2 81.28,15.88 v81.28,15.9
A19  (1 unrouted)
A20  (1 unrouted)
BDRA0  (4 unrouted)
BDRA1  (4 unrouted)
BDRA2  (4 unrouted)
BDRA3  (4 unrouted)
BDRA4  (4 unrouted)
BDRA5  (4 unrouted)
BDRA6  (4 unrouted)
BDRA7  (4 unrouted)
BDRA8  (4 unrouted)
C28MHZ  (1 unrouted)
CC@4  (1 unrouted)
CCK  (6 unrouted)
CCK_4  (1 unrouted)
CCK_A  (2 unrouted)
CCKQ  (4 unrouted)
CCKQ_A  (1 unrouted)
CPUCLK  (4 unrouted)
CPUCLK_A  (2 unrouted)
D0  (2 unrouted)
D1  (2 unrouted)
D2  (2 unrouted)
D3  (2 unrouted)
D4  (2 unrouted)
D5  (2 unrouted)
D6  (2 unrouted)
D7  (2 unrouted)
D8  (2 unrouted)
D9  (2 unrouted)
D10  (2 unrouted)
D11  (2 unrouted)
D12  (2 unrouted)
D13  (2 unrouted)
D14  (2 unrouted)
D15  (2 unrouted)
D16  (2 unrouted)
D17  (2 unrouted)
D18  (2 unrouted)
D19  (2 unrouted)
D20  (2 unrouted)
D21  (2 unrouted)
D22  (2 unrouted)
D23  (2 unrouted)
D24  (2 unrouted)
D25  (2 unrouted)
D26  (2 unrouted)
D27  (2 unrouted)
D28  (2 unrouted)
D29  (2 unrouted)
D30  (2 unrouted)
D31  (2 unrouted)
DRA0  (2 unrouted)
DRA1  (1 unrouted)
DRA2  (1 unrouted)
DRA3  (1 unrouted)
DRA4  (1 unrouted)
DRA5  (1 unrouted)
DRA6  (1 unrouted)
DRA7  (1 unrouted)
DRA8  (1 unrouted)
DRD0  (6 unrouted)
DRD1  (6 unrouted)
DRD2  (6 unrouted)
DRD3  (6 unrouted)
DRD4  (6 unrouted)
DRD5  (6 unrouted)
DRD6  (6 unrouted)
DRD7  (6 unrouted)
DRD8  (6 unrouted)
DRD9  (6 unrouted)
DRD10  (6 unrouted)
DRD11  (6 unrouted)
DRD12  (6 unrouted)
DRD13  (6 unrouted)
DRD14  (6 unrouted)
DRD15  (6 unrouted)
DRD16  (7 unrouted)
DRD17  (7 unrouted)
DRD18  (7 unrouted)
DRD19  (7 unrouted)
DRD20  (7 unrouted)
DRD21  (7 unrouted)
DRD22  (7 unrouted)
DRD23  (7 unrouted)
DRD24  (7 unrouted)
DRD25  (7 unrouted)
DRD26  (7 unrouted)
DRD27  (7 unrouted)
DRD28  (7 unrouted)
DRD29  (7 unrouted)
DRD30  (7 unrouted)
DRD31  (7 unrouted)
FC0  (1 unrouted)
FC1  (1 unrouted)
FC2  (1 unrouted)
GND  (61 unrouted)
  Top 0.61: U6A.12 U6A.31 U6B.12 U6B.31
GND1  (3 unrouted)
GND2  (3 unrouted)
IPL0  (1 unrouted)
IPL1  (1 unrouted)
IPL2  (1 unrouted)
N$1  (5 unrouted)
N$2  (1 unrouted)
N$3  (1 unrouted)
N$4  (1 unrouted)
N$5  (2 unrouted)
N$6  (1 unrouted)
N$7  (2 unrouted)
N$8  (4 unrouted)
N$9  (1 unrouted)
N$10  (1 unrouted)
N$13  (1 unrouted)
N$22  (1 unrouted)
N$23  (1 unrouted)
N$24  (1 unrouted)
N$25  (1 unrouted)
N$30  (1 unrouted)
N$31  (1 unrouted)
N$34  (1 unrouted)
N$35  (1 unrouted)
N$36  (1 unrouted)
N$37  (1 unrouted)
R_W  (3 unrouted)
RGA1  (4 unrouted)
RGA2  (4 unrouted)
RGA3  (4 unrouted)
RGA4  (4 unrouted)
RGA5  (4 unrouted)
RGA6  (4 unrouted)
RGA7  (4 unrouted)
RGA8  (4 unrouted)
SCLK  (2 unrouted)
SIZE_0  (2 unrouted)
SIZE_1  (2 unrouted)
VCC  (50 unrouted)
VCC0  (3 unrouted)
VCC1  (4 unrouted)
VCC2  (4 unrouted)
XC280  (4 unrouted)
XRDY  (1 unrouted)
XSOG  (3 unrouted)
XZD  (3 unrouted)

## Text on the board
tPlace: B | C | F | R151A/I | PAL / NTSC | 28.37516 MHz / 28.63636 MHz | E124R/C | E125C/R | Kickstart | E123C/R | ENABLE | FASTER | E126C/R | UPDATE | SPEED | DISABLE | NORMAL | E128C/R | E122C/R | Power | Reset | E127C/R | HDD | E121C/R | FDD | PWR | E129C/R | E124C/R | P1 | CBM A1200 Expansion Edge Connector | AUG-2020 | u1200 | 1D4:0.8 | WISH YOU WERE HERE | R | S | H | J | CC BY-SA 4.0 | github.com/betajaen/u1200 | LOW | HIGH | L | P | E